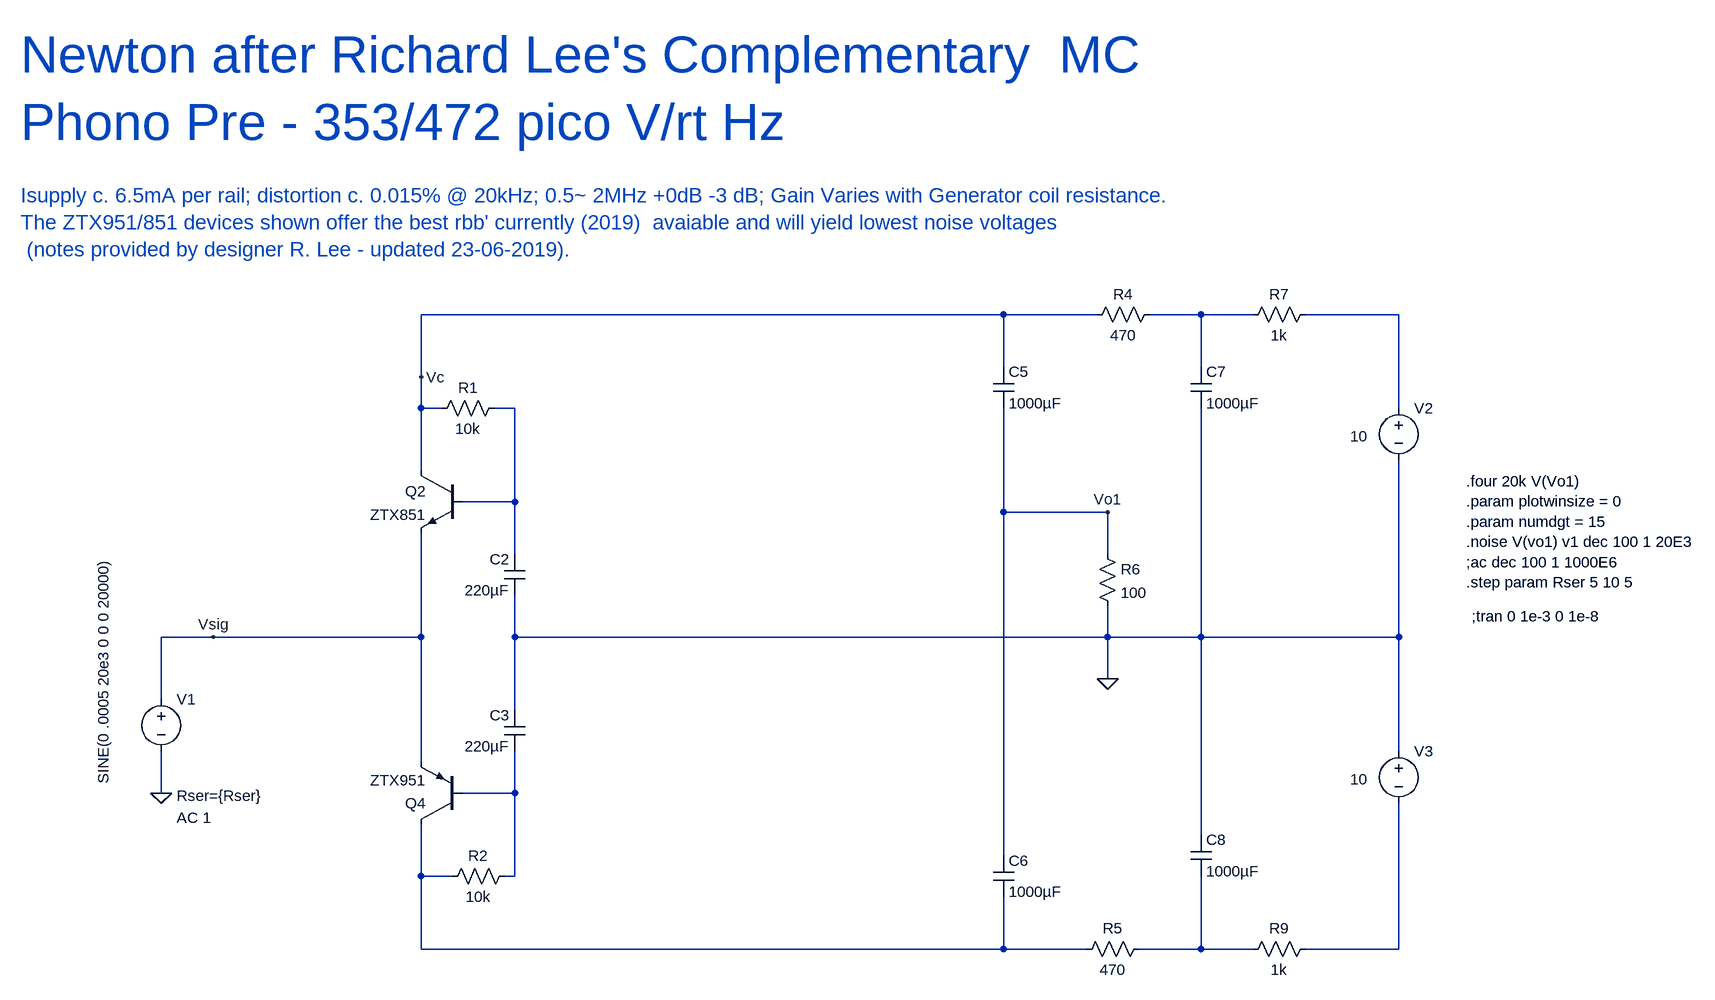
[diagram p0: schematic Newton.asc]
Newton.asc, the LTspice schematic file:
Version 4
SHEET 1 2900 680
WIRE 736 -528 -160 -528
WIRE 880 -528 736 -528
WIRE 1040 -528 960 -528
WIRE 1120 -528 1040 -528
WIRE 1344 -528 1200 -528
WIRE 736 -448 736 -528
WIRE 1040 -448 1040 -528
WIRE -160 -432 -160 -528
WIRE -160 -384 -160 -432
WIRE -128 -384 -160 -384
WIRE -16 -384 -48 -384
WIRE 1344 -384 1344 -528
WIRE -160 -288 -160 -384
WIRE -16 -240 -16 -384
WIRE -16 -240 -96 -240
WIRE 736 -224 736 -384
WIRE 896 -224 736 -224
WIRE -16 -160 -16 -240
WIRE 896 -160 896 -224
WIRE -480 -32 -560 -32
WIRE -160 -32 -160 -192
WIRE -160 -32 -480 -32
WIRE -16 -32 -16 -96
WIRE 896 -32 896 -80
WIRE 896 -32 -16 -32
WIRE 1040 -32 1040 -384
WIRE 1040 -32 896 -32
WIRE 1344 -32 1344 -304
WIRE 1344 -32 1040 -32
WIRE 896 32 896 -32
WIRE -560 64 -560 -32
WIRE -16 80 -16 -32
WIRE 1344 144 1344 -32
WIRE -160 160 -160 -32
WIRE -560 208 -560 144
WIRE -16 208 -16 144
WIRE -16 208 -96 208
WIRE 1040 272 1040 -32
WIRE 736 304 736 -224
WIRE -160 336 -160 256
WIRE -112 336 -160 336
WIRE -16 336 -16 208
WIRE -16 336 -32 336
WIRE -160 448 -160 336
WIRE 736 448 736 368
WIRE 736 448 -160 448
WIRE 864 448 736 448
WIRE 1040 448 1040 336
WIRE 1040 448 944 448
WIRE 1120 448 1040 448
WIRE 1344 448 1344 224
WIRE 1344 448 1200 448
FLAG -560 208 0
FLAG 896 32 0
FLAG 896 -224 Vo1
FLAG -160 -432 Vc
FLAG -480 -32 Vsig
SYMBOL voltage -560 48 R0
WINDOW 3 -89 -203 VRight 2
WINDOW 123 24 198 Left 2
WINDOW 39 24 164 Left 2
SYMATTR Value SINE(0 .0005 20e3 0 0 0 20000)
SYMATTR Value2 AC 1
SYMATTR SpiceLine Rser={Rser}
SYMATTR InstName V1
SYMBOL voltage 1344 -400 R0
WINDOW 3 -75 59 Left 2
WINDOW 123 -75 93 Left 2
WINDOW 39 0 0 Left 2
SYMATTR Value 10
SYMATTR InstName V2
SYMBOL npn -96 -288 M0
SYMATTR InstName Q2
SYMATTR Value ZTX851
SYMBOL pnp -96 256 R180
SYMATTR InstName Q4
SYMATTR Value ZTX951
SYMBOL res -144 -368 R270
WINDOW 0 32 56 VTop 2
WINDOW 3 0 56 VBottom 2
SYMATTR InstName R1
SYMATTR Value 10k
SYMBOL res -16 320 R90
WINDOW 0 0 56 VBottom 2
WINDOW 3 32 56 VTop 2
SYMATTR InstName R2
SYMATTR Value 10k
SYMBOL cap 0 -96 R180
WINDOW 0 24 56 Left 2
WINDOW 3 24 8 Left 2
SYMATTR InstName C2
SYMATTR Value 220µF
SYMBOL cap 0 144 R180
WINDOW 0 24 56 Left 2
WINDOW 3 24 8 Left 2
SYMATTR InstName C3
SYMATTR Value 220µF
SYMBOL res 976 -544 R90
WINDOW 0 0 56 VBottom 2
WINDOW 3 32 56 VTop 2
SYMATTR InstName R4
SYMATTR Value 470
SYMBOL res 960 432 R90
WINDOW 0 0 56 VBottom 2
WINDOW 3 32 56 VTop 2
SYMATTR InstName R5
SYMATTR Value 470
SYMBOL cap 720 -448 R0
SYMATTR InstName C5
SYMATTR Value 1000µF
SYMBOL cap 720 304 R0
SYMATTR InstName C6
SYMATTR Value 1000µF
SYMBOL res 880 -176 R0
SYMATTR InstName R6
SYMATTR Value 100
SYMBOL res 1216 -544 R90
WINDOW 0 0 56 VBottom 2
WINDOW 3 32 56 VTop 2
SYMATTR InstName R7
SYMATTR Value 1k
SYMBOL res 1216 432 R90
WINDOW 0 0 56 VBottom 2
WINDOW 3 32 56 VTop 2
SYMATTR InstName R9
SYMATTR Value 1k
SYMBOL cap 1024 -448 R0
SYMATTR InstName C7
SYMATTR Value 1000µF
SYMBOL cap 1024 272 R0
SYMATTR InstName C8
SYMATTR Value 1000µF
SYMBOL voltage 1344 128 R0
WINDOW 3 -75 59 Left 2
WINDOW 123 24 130 Left 2
WINDOW 39 0 0 Left 2
SYMATTR Value 10
SYMATTR InstName V3
TEXT 1456 -64 Left 2 !;tran 0 1e-3 0 1e-8
TEXT 1448 -272 Left 2 !.four 20k V(Vo1)\n.param plotwinsize = 0\n.param numdgt = 15\n.noise V(vo1) v1 dec 100 1 20E3\n;ac dec 100 1 1000E6\n.step param Rser 5 10 5
TEXT -776 -928 Left 6 ;Newton after Richard Lee's Complementary  MC \nPhono Pre - 353/472 pico V/rt Hz
TEXT -776 -712 Left 3 ;Isupply c. 6.5mA per rail; distortion c. 0.015% @ 20kHz; 0.5~ 2MHz +0dB -3 dB; Gain Varies with Generator coil resistance.\nThe ZTX951/851 devices shown offer the best rbb' currently (2019)  avaiable and will yield lowest noise voltages \n (notes provided by designer R. Lee - updated 23-06-2019).

The netlist it stands for:
* Newton.asc
V1 Vsig 0 SINE(0 .0005 20e3 0 0 0 20000) AC 1 Rser={Rser}
V2 N002 0 10
Q2 Vc N003 Vsig 0 ZTX851
Q4 N005 N004 Vsig 0 ZTX951
R1 Vc N003 10k
R2 N004 N005 10k
C2 0 N003 220µF
C3 N004 0 220µF
R4 N001 Vc 470
R5 N006 N005 470
C5 Vc Vo1 1000µF
C6 Vo1 N005 1000µF
R6 Vo1 0 100
R7 N002 N001 1k
R9 N007 N006 1k
C7 N001 0 1000µF
C8 0 N006 1000µF
V3 0 N007 10
.model NPN NPN
.model PNP PNP
.lib standard.bjt
;tran 0 1e-3 0 1e-8
.four 20k V(Vo1)
.param plotwinsize = 0
.param numdgt = 15
.noise V(vo1) v1 dec 100 1 20E3
;ac dec 100 1 1000E6
.step param Rser 5 10 5
* Newton after Richard Lee's Complementary  MC
* Phono Pre - 353/472 pico V/rt Hz
* Isupply c. 6.5mA per rail; distortion c. 0.015% @ 20kHz; 0.5~ 2MHz +0dB -3 dB; Gain Varies with Generator coil resistance.
* The ZTX951/851 devices shown offer the best rbb' currently (2019)  avaiable and will yield lowest noise voltages
*  (notes provided by designer R. Lee - updated 23-06-2019).
.backanno
.end